# Altium schematic sheet FPGA_CONFIG.SchDoc
size A4
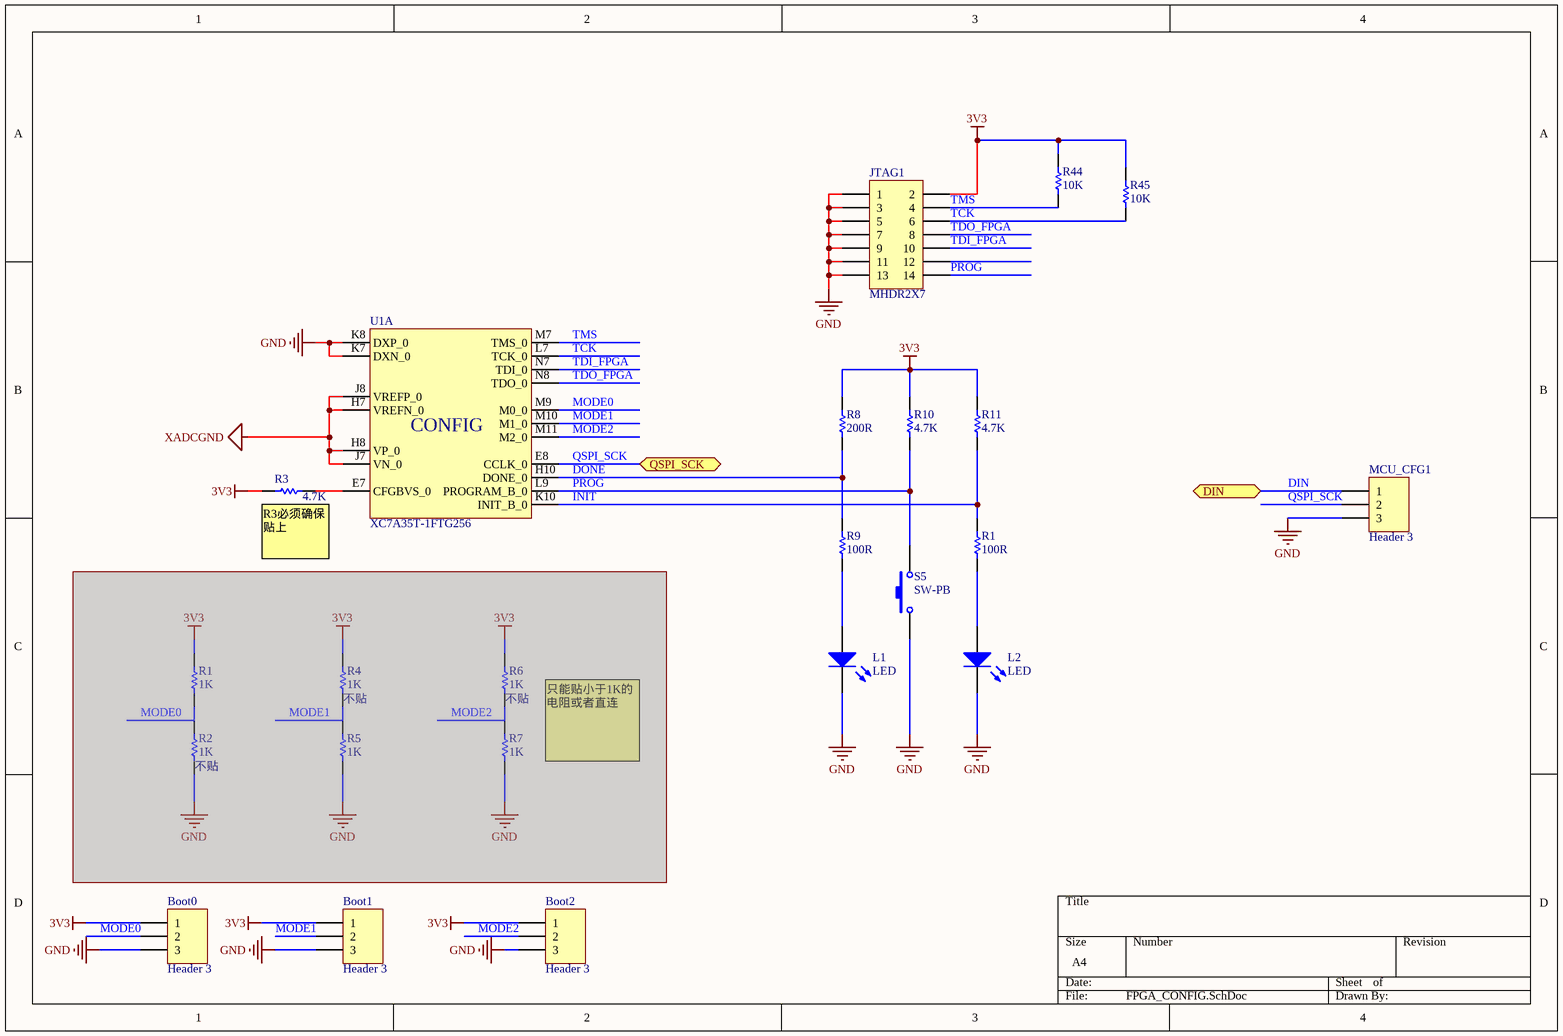
[diagram p0: FPGA_CONFIG.SchDoc]

## Parts
(Parts that share a designator on the sheet are numbered #1, #2 ... from top to bottom, then left to right.)
Boot0  Header 3  [HDR1X3]
Boot1  Header 3  [HDR1X3]
Boot2  Header 3  [HDR1X3]
JTAG1  MHDR2X7  [Hearder2 7X2]
L1  LED  [C2012]
L2  LED  [C2012]
MCU_CFG1  Header 3  [HDR1X3]
R1#1  value 100R  [1608[0603]]  (hidden comment: Res)
R1#2  value 1K  [1608[0603]]  (hidden comment: Res)  (masked out: inside a compile mask, not in the netlist)
R2  不贴  value 1K  [1608[0603]]  (masked out: inside a compile mask, not in the netlist)
R3  value 4.7K  [0402]  (hidden comment: Res)
R4  不贴  value 1K  [1608[0603]]  (masked out: inside a compile mask, not in the netlist)
R5  value 1K  [1608[0603]]  (hidden comment: Res)  (masked out: inside a compile mask, not in the netlist)
R6  不贴  value 1K  [1608[0603]]  (masked out: inside a compile mask, not in the netlist)
R7  value 1K  [1608[0603]]  (hidden comment: Res)  (masked out: inside a compile mask, not in the netlist)
R8  value 200R  [1608[0603]]  (hidden comment: Res)
R9  value 100R  [1608[0603]]  (hidden comment: Res)
R10  value 4.7K  [1608[0603]]  (hidden comment: Res)
R11  value 4.7K  [1608[0603]]  (hidden comment: Res)
R44  value 10K  [1608[0603]]  (hidden comment: Res)
R45  value 10K  [1608[0603]]  (hidden comment: Res)
S5  SW-PB  [key 3*4*2]
U1  XC7A35T-1FTG256  [BGA100P9X9-81A]  (part A of 7)

## Ports
DIN, QSPI_SCK

## Nets
3V3: Boot0.1 Boot1.1 Boot2.1 JTAG1.2 R3.1 R8.2 R10.2 R11.2 R44.2 R45.2
GND: Boot0.3 Boot1.3 Boot2.3 JTAG1.1 JTAG1.3 JTAG1.5 JTAG1.7 JTAG1.9 JTAG1.11 JTAG1.13 L1.2(K) L2.2(K) MCU_CFG1.3 S5.1 U1.K7(DXN_0) U1.K8(DXP_0)
XADCGND: U1.H7(VREFN_0) U1.H8(VP_0) U1.J7(VN_0) U1.J8(VREFP_0)
DIN: MCU_CFG1.1 ; port DIN
DONE: R8.1 R9.2 U1.H10(DONE_0)
INIT: R1#1.2 R11.1 U1.K10(INIT_B_0)
MODE0: Boot0.2 U1.M9(M0_0)
MODE1: Boot1.2 U1.M10(M1_0)
MODE2: Boot2.2 U1.M11(M2_0)
PROG: JTAG1.14 R10.1 S5.2 U1.L9(PROGRAM_B_0)
QSPI_SCK: MCU_CFG1.2 U1.E8(CCLK_0) ; port QSPI_SCK
TCK: JTAG1.6 R45.1 U1.L7(TCK_0)
TDI_FPGA: JTAG1.10 U1.N7(TDI_0)
TDO_FPGA: JTAG1.8 U1.N8(TDO_0)
TMS: JTAG1.4 R44.1 U1.M7(TMS_0)
NetL1_1: L1.1(A) R9.1
NetL2_1: L2.1(A) R1#1.1
NetR3_2: R3.2 U1.E7(CFGBVS_0)

Not connected (* = marked no-connect by the designer): JTAG1 12

## Notes on the sheet
- (near R3) R3必须确保贴上
- 只能贴小于1K的电阻或者直连
- (in symbol XC7A35T-1FTG256, part A) CONFIG

## Library data of the parts
Boot0-Boot2 MCU_CFG1 = Header 3: Header, 3-Pin; LatestRevisionDate: 17-Jul-2002; LatestRevisionNote: Re-released for DXP Platform.; Publisher: Altium Limited
JTAG1 = MHDR2X7: Header, 7-Pin, Dual row; LatestRevisionDate: 17-Jul-2002; LatestRevisionNote: Re-released for DXP Platform.; Publisher: Altium Limited
R1#1 R1#2 R2-R11 R44 R45 = Res: 贴片电阻; Published: 8-Jun-2000; LatestRevisionDate: 17-Jul-2002; LatestRevisionNote: Re-released for DXP Platform.; PackageReference: AXIAL-0.3; Publisher: Altium Limited
S5 = SW-PB: Switch; Published: 24-Mar-1999; LatestRevisionDate: 17-Jul-2002; LatestRevisionNote: Re-released for DXP Platform.; PackageReference: SPST-2; Publisher: Altium Limited; PackageDescription: Switch; 2 Leads